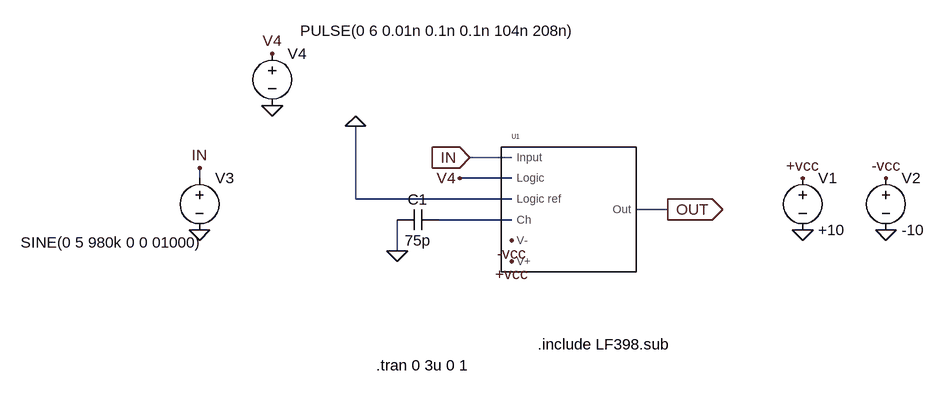
[diagram p0: schematic sh.asc]
sh.asc, the LTspice schematic file:
Version 4
SHEET 1 880 680
WIRE -224 96 -288 96
WIRE -704 128 -704 112
WIRE -224 128 -304 128
WIRE -464 160 -464 48
WIRE -224 160 -464 160
WIRE 16 176 -32 176
WIRE -224 192 -336 192
WIRE -400 240 -400 192
FLAG -288 96 IN
IOPIN -288 96 In
FLAG 16 176 OUT
IOPIN 16 176 Out
FLAG 224 208 0
FLAG 352 208 0
FLAG 224 128 +vcc
FLAG -224 256 +vcc
FLAG 352 128 -vcc
FLAG -224 224 -vcc
FLAG -704 208 0
FLAG -704 112 IN
FLAG -400 240 0
FLAG -592 16 0
FLAG -592 -64 V4
FLAG -464 48 0
FLAG -304 128 V4
SYMBOL lf398 -160 144 R0
SYMATTR InstName U1
SYMBOL cap -336 176 R90
WINDOW 0 0 32 VBottom 2
WINDOW 3 32 32 VTop 2
SYMATTR InstName C1
SYMATTR Value 75p
SYMBOL voltage 224 112 R0
WINDOW 123 0 0 Left 0
WINDOW 39 0 0 Left 0
SYMATTR InstName V1
SYMATTR Value +10
SYMBOL voltage 352 112 R0
WINDOW 123 0 0 Left 0
WINDOW 39 0 0 Left 0
SYMATTR InstName V2
SYMATTR Value -10
SYMBOL voltage -704 112 R0
WINDOW 123 0 0 Left 0
WINDOW 39 0 0 Left 0
WINDOW 3 -275 115 Left 2
SYMATTR InstName V3
SYMATTR Value SINE(0 5 980k 0 0 01000)
SYMBOL voltage -592 -80 R0
WINDOW 3 43 -19 Left 2
WINDOW 123 0 0 Left 0
WINDOW 39 0 0 Left 0
SYMATTR InstName V4
SYMATTR Value PULSE(0 6 0.01n 0.1n 0.1n 104n 208n)
TEXT -432 416 Left 2 !.tran 0 3u 0 1
TEXT -184 384 Left 2 !.include LF398.sub

The netlist it stands for:
* sh.asc
XU1 IN V4 0 -vcc N001 OUT +vcc LF398H  ; pins Input Logic Logic_ref V- Ch Out V+
C1 N001 0 75p
V1 +vcc 0 +10
V2 -vcc 0 -10
V3 IN 0 SINE(0 5 980k 0 0 01000)
V4 V4 0 PULSE(0 6 0.01n 0.1n 0.1n 104n 208n)
.tran 0 3u 0 1
.include LF398.sub
.backanno
.end